# EAGLE design Police Siren using Timer555 (EAGLE 9.6.2)
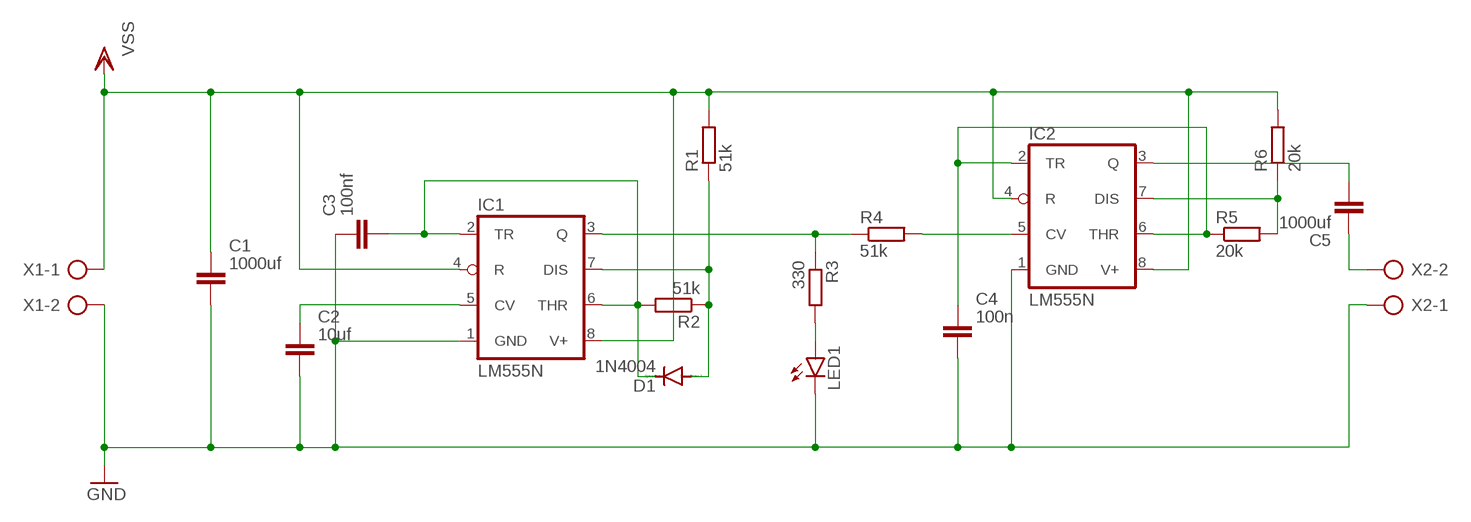
[diagram p0: schematic, sheet 1]

## Parts
C1  1000uf  C_RADIAL-12.5MM-DIA  [CAPRD550W60D1025H1250B]
C2  10uf  C_RADIAL-12.5MM-DIA  [CAPRD550W60D1025H1250B]
C3  100nf  C_RADIAL-12.5MM-DIA  [CAPRD550W60D1025H1250B]
C4  100n  C_RADIAL-12.5MM-DIA  [CAPRD550W60D1025H1250B]
C5  1000uf  C_RADIAL-12.5MM-DIA  [CAPRD550W60D1025H1250B]
D1  1N4004  [DO41-10]
IC1  LM555N  [DIL08]
IC2  LM555N  [DIL08]
LED1  LED3MM  [LED3MM]
R1  51k  R-EU_0204/7  [0204/7]
R2  51k  R-EU_0204/7  [0204/7]
R3  330  R-EU_0204/7  [0204/7]
R4  51k  R-EU_0204/7  [0204/7]
R5  20k  R-EU_0204/7  [0204/7]
R6  20k  R-EU_0204/7  [0204/7]
X1  AK300/2  [AK300/2]
X2  AK300/2  [AK300/2]

## Nets
GND: C1.2 C2.2 C3.1 C4.2 IC1.1(GND) IC2.1(GND) LED1.K(C) X1.2 X2.1
N$1: IC1.3(Q) R3.1 R4.1
N$2: LED1.A R3.2
N$3: C2.1 IC1.5(CV)
N$4: C3.2 D1.C IC1.2(TR) IC1.6(THR) R2.2
N$5: IC2.5(CV) R4.2
N$6: D1.A IC1.7(DIS) R1.1 R2.1
N$7: C5.2 IC2.3(Q)
N$8: C5.1 X2.2
N$9: C4.1 IC2.2(TR) IC2.6(THR) R5.1
N$10: IC2.7(DIS) R5.2 R6.1
VSS: C1.1 IC1.4(R) IC1.8(V+) IC2.4(R) IC2.8(V+) R1.2 R6.2 X1.1

## Library data of the parts
C1-C5 = Capacitor:C: Capacitor - Generic; CATEGORY: Capacitor
D1 = diode:1N4004: DIODE general purpose rectifier, 1 A
IC1 IC2 = linear:*555: TIMER
LED1 = led:LED: LED OSRAM: - CHIPLED LG R971, LG N971, LY N971, LG Q971, LY Q971, LO R971, LY R971 LH N974, LH R974 LS Q976, LO Q976, LY Q976 LO Q996 - Hyper CHIPLED LW Q18S LB Q993, LB Q99A, LB R99A - SideLED LS A670, LO A670, LY A670, LG A670, LP A670 LB A673, LV A673, LT A673, LW A673 LH A674 LY A675 LS A676, LA A676, LO A676, LY A676, LW A676 LS A679, LY A679, LG A679 - Hyper Micro SIDELED® LS Y876, LA Y876, LO Y876, LY Y876 LT Y87S - SmartLED LW L88C, LW L88S LB L89C, LB L89S, LG L890 LS L89K, LO L89K, LY L89K LS L896, LA L896, LO L896, LY L896 - TOPLED LS T670, LO T670, LY T670, LG T670, LP T670 LSG T670, LSP T670, LSY T670, LOP T670, LYG T670 LG T671, LOG T671, LSG T671 LB T673, LV T673, LT T673, LW T673 LH T674 LS T676, LA T676, LO T676, LY T676, LB T676, LH T676, LSB T676, LW T676 LB T67C, LV T67C, LT T67C, LS T67K, LO T67K, LY T67K, LW E67C LS E67B, LA E67B, LO E67B, LY E67B, LB E67C, LV E67C, LT E67C LW T67C LS T679, LY T679, LG T679 LS T770, LO T770, LY T770, LG T770, LP T770 LB T773, LV T773, LT T773, LW T773 LH T774 LS E675, LA E675, LY E675, LS T675 LS T776, LA T776, LO T776, LY T776, LB T776 LHGB T686 LT T68C, LB T68C - Hyper Mini TOPLED® LB M676 - Mini TOPLED Santana® LG M470 LS M47K, LO M47K, LY M47K Source: http://www.osram.convergy.de LUXEON: - LUMILED® LXK2-PW12-R00, LXK2-PW12-S00, LXK2-PW14-U00, LXK2-PW14-V00 LXK2-PM12-R00, LXK2-PM12-S00, LXK2-PM14-U00 LXK2-PE12-Q00, LXK2-PE12-R00, LXK2-PE12-S00, LXK2-PE14-T00, LXK2-PE14-U00 LXK2-PB12-K00, LXK2-PB12-L00, LXK2-PB12-M00, LXK2-PB14-N00, LXK2-PB14-P00, LXK2-PB14-Q00 LXK2-PR12-L00, LXK2-PR12-M00, LXK2-PR14-Q00, LXK2-PR14-R00 LXK2-PD12-Q00, LXK2-PD12-R00, LXK2-PD12-S00 LXK2-PH12-R00, LXK2-PH12-S00 LXK2-PL12-P00, LXK2-PL12-Q00, LXK2-PL12-R00 Source: www.luxeon.com KINGBRIGHT: KA-3528ASYC Source: www.kingbright.com
R1-R6 = rcl:R-EU_: RESISTOR, European symbol; SPICEPREFIX: R
X1 X2 = con-ptr500:AK300/2: CONNECTOR; OC_FARNELL: unknown; OC_NEWARK: unknown

## Board
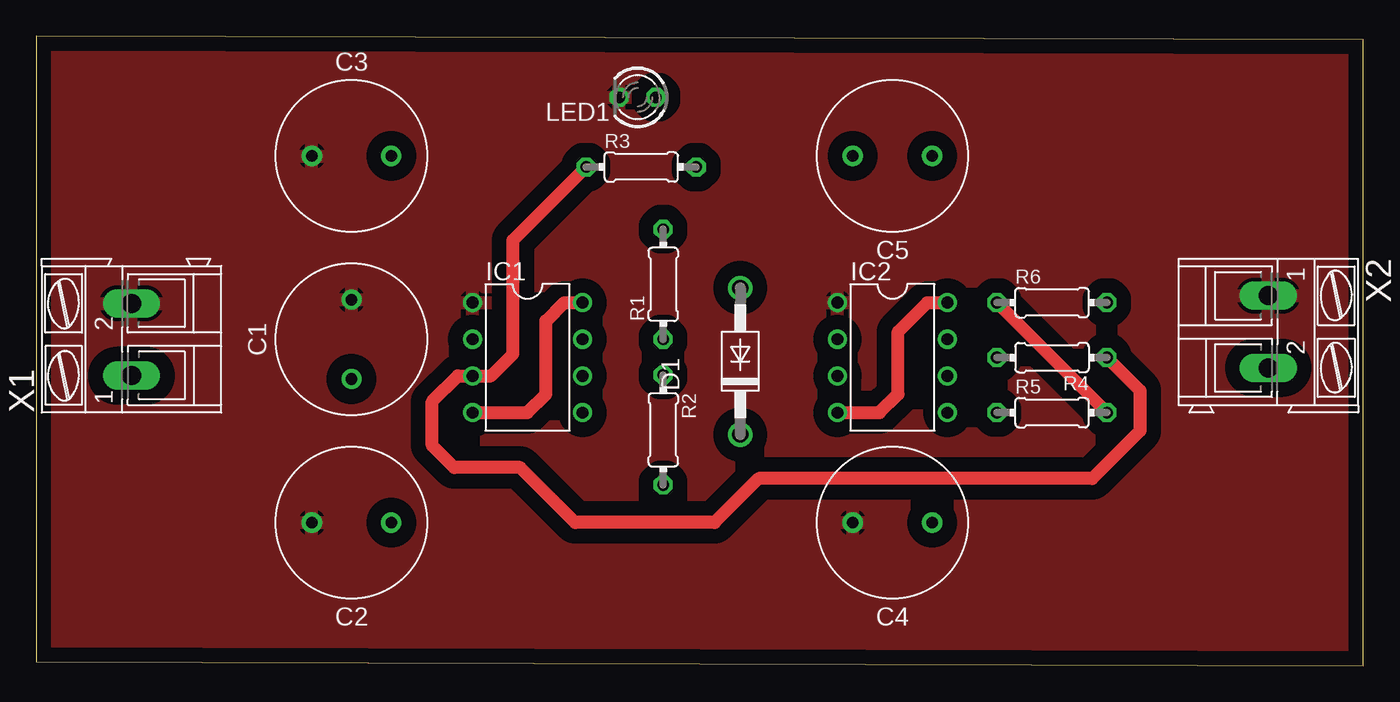
[diagram p1: board, top side]
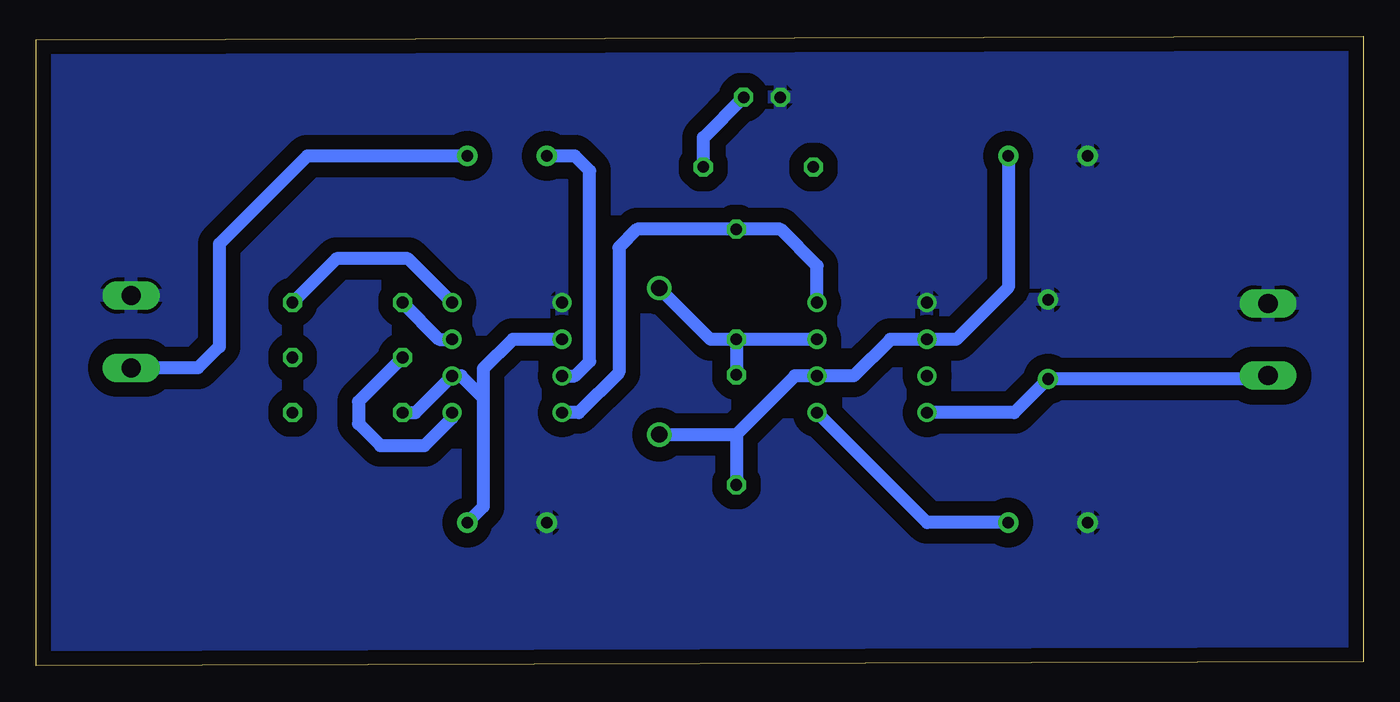
[diagram p2: board, bottom side, seen from below]

Size 91.93 x 43.61 mm. Coordinates in mm from the lower left corner, seen from the top.
Outline: 0,0.25 91.93,0 91.93,43.36 0,43.61 0,0.25
Copper layers (1*16): Top 0.035mm / dielectric 1.5mm / Bottom 0.035mm
Design rules "default *": minimum track width 36mil, minimum drill 0.35mm, track to track 16mil, track to pad 16mil, pad to pad 6mil, via to via 6mil, smd to smd 6mil, copper to edge 40mil, drill to drill 6mil, minimum pad ring 10mil, minimum via ring 8mil, stop-mask expansion 4mil, vias tented up to drill 0mil, thermal gap 10mil

### Footprints (pad centres in the part's own frame; a part is rotated, then mirrored left to right if it is on the bottom)
CAPRD550W60D1025H1250B = drill 0.8 pad 1.4: 1 -2.75,0; 2 2.75,0
DO41-10 = drill 1.118: A 5.08,0; C -5.08,0
DIL08 = drill 0.813 pad 1.27: 1 -3.81,-3.81; 2 -1.27,-3.81; 3 1.27,-3.81; 4 3.81,-3.81; 5 3.81,3.81; 6 1.27,3.81; 7 -1.27,3.81; 8 -3.81,3.81
LED3MM = drill 0.813 octagon: A -1.27,0; K 1.27,0
0204/7 = drill 0.813 octagon: 1 -3.81,0; 2 3.81,0
AK300/2 = drill 1.321 long: 1 -2.515,0; 2 2.489,0

### Placement (x,y rotation side)
C1  21.84,22.61 90 top
C2  21.84,9.91 180 top
C3  21.84,35.31 0 top
C4  59.31,9.91 180 top
C5  59.31,35.31 180 top
D1  48.77,21.08 90 top
IC1  34.04,21.34 270 top
IC2  59.31,21.34 270 top
LED1  41.66,39.37 180 top
R1  43.43,26.42 90 top
R2  43.43,16.33 270 top
R3  41.91,34.54 0 top
R4  70.36,21.34 180 top
R5  70.36,17.53 0 top
R6  70.36,25.15 0 top
X1  6.6,22.61 90 top
X2  85.34,23.11 270 top

### Tracks (layer width: path | path; a pad name or v marks a point on that pad's centre or on a via)
GND
  pour Bottom (isolate 1.016): -1.52,48.01 97.03,48.01 97.03,-1.78 -1.52,-1.78
  pour Top (isolate 1.016): -4.32,52.58 101.09,52.58 101.09,-5.84 -4.32,-5.84
N$1
  Top 0.914: R4.1 76.45,19.05 76.45,16.26 73.15,12.95 50.04,12.95 46.99,9.91 37.34,9.91 33.53,13.72 28.96,13.72 27.43,15.24 27.43,18.29 29.21,20.07 IC1.3 31.5,20.07 33.02,21.59 33.02,29.46 R3.1
N$2
  Bottom 0.914: R3.2 45.72,36.58 LED1.A
N$3
  Bottom 0.914: C2.1 30.23,9.91 IC1.5
N$4
  Bottom 0.914: C3.2 24.59,26.21 28.19,22.61 IC1.2 32.77,22.61 35.31,20.07 IC1.6 39.37,20.07 43.43,16 | 43.43,16 R2.2 | D1.C 43.43,16
N$5
  Bottom 0.914: R4.2 69.6,18.29 69.6,16.76 68.07,15.24 65.02,15.24 63.12,17.15 IC2.5
N$6
  Bottom 0.914: IC1.7 R1.1 | R1.1 45.21,22.61 D1.A | R1.1 R2.1
N$7
  Bottom 0.914: IC2.3 54.61,20.07 53.59,21.08 53.59,34.29 54.61,35.31 C5.2
N$8
  Bottom 0.914: C5.1 73.15,35.31 79.25,29.21 79.25,22.1 80.72,20.62 X2.2
N$9
  Bottom 0.914: C4.1 60.96,11.01 60.96,18.54 | 60.96,18.54 62.48,20.07 IC2.6 65.66,17.53 R5.1 | IC2.2 58.93,22.61 60.96,20.57 60.96,18.54
N$10
  Top 0.914: R6.1 R5.2
  Bottom 0.914: R6.1 64.01,22.61 IC2.7
VSS
  Top 0.914: IC1.4 34.04,17.53 35.31,18.8 35.31,23.88 36.58,25.15 IC1.8 | IC2.4 58.42,17.53 59.69,18.8 59.69,23.11 61.72,25.15 IC2.8
  Bottom 0.914: IC1.4 24.17,17.53 C1.1 6.84,19.86 X1.1 | IC1.8 37.85,27.69 40.39,30.23 R1.2 50.29,30.23 51.56,28.96 51.56,20.32 54.36,17.53 IC2.4 | IC2.8 66.17,28.19 71.12,28.19 R6.2